# Altium schematic sheet 2 power supply.SchDoc
size A4; SheetNumber: 2; SheetTotal: 4
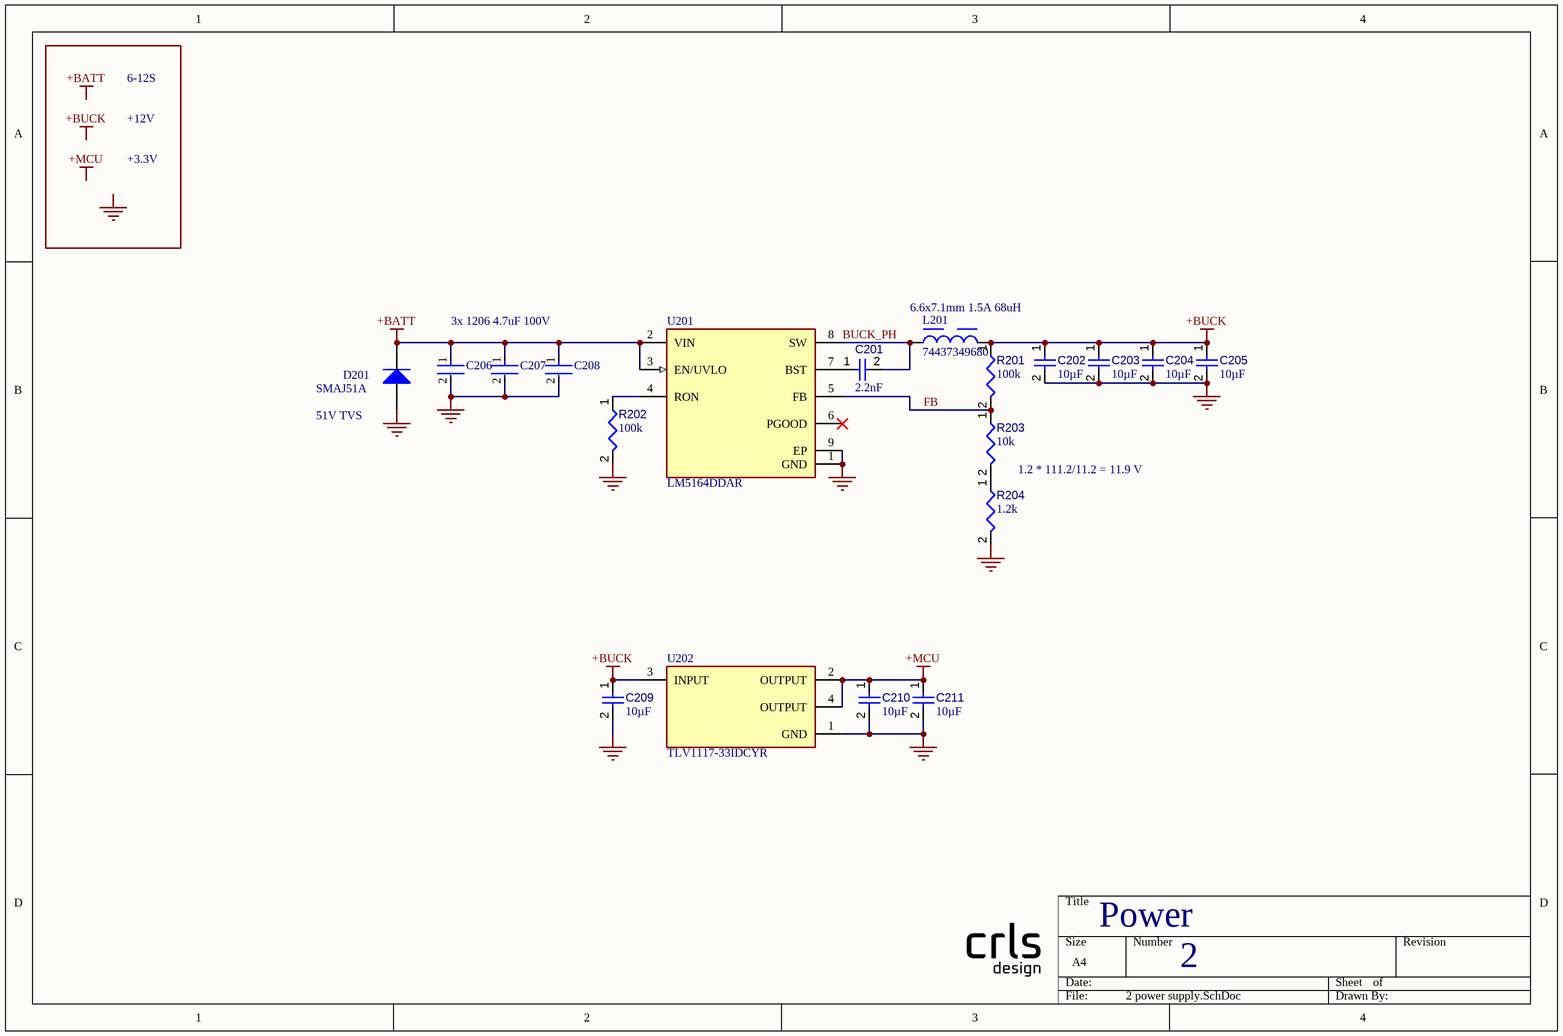
[diagram p0: 2 power supply.SchDoc]

## Parts
C201  value 2.2nF  [CAPC0402(1005)33_L]  (hidden comment: Capacitor 2.2nF +/-20% 50V 0402)
C202  value 10µF  [CAPC0603(1608)100_L]  (hidden comment: Capacitor 10µF +/-20% 10V 0603)
C203  value 10µF  [CAPC0603(1608)100_L]  (hidden comment: Capacitor 10µF +/-20% 10V 0603)
C204  value 10µF  [CAPC0603(1608)100_L]  (hidden comment: Capacitor 10µF +/-20% 10V 0603)
C205  value 10µF  [CAPC0603(1608)100_L]  (hidden comment: Capacitor 10µF +/-20% 10V 0603)
C206  12061Z475KAT2A  [FP-1206-L_3_2_0_2-W_1_6_0-MFG]  (value not drawn)
C207  12061Z475KAT2A  [FP-1206-L_3_2_0_2-W_1_6_0-MFG]  (value not drawn)
C208  12061Z475KAT2A  [FP-1206-L_3_2_0_2-W_1_6_0-MFG]  (value not drawn)
C209  value 10µF  [CAPC0603(1608)100_L]  (hidden comment: Capacitor 10µF +/-20% 10V 0603)
C210  value 10µF  [CAPC0603(1608)100_L]  (hidden comment: Capacitor 10µF +/-20% 10V 0603)
C211  value 10µF  [CAPC0603(1608)100_L]  (hidden comment: Capacitor 10µF +/-20% 10V 0603)
D201  SMAJ51A  [VISH-DO-214AC-2_N]
L201  74437349680  [WE-LHMI_7050]
R201  value 100k  [RESC0402(1005)_L]  (hidden comment: Resistor 100K +/-1 % 0402 63 mW)
R202  value 100k  [RESC0402(1005)_L]  (hidden comment: Resistor 100K +/-1 % 0402 63 mW)
R203  value 10k  [RESC0402(1005)_L]  (hidden comment: Resistor 10K  +/-1 % 0402 63 mW)
R204  value 1.2k  [RESC0402(1005)_L]  (hidden comment: Resistor 1K2 +/-1 % 0402 63 mW)
U201  LM5164DDAR  [FP-DDA0008E-MFG]
U202  TLV1117-33IDCYR  [FP-DCY0004A-MFG]

## Nets
+BATT: C206.1 C207.1 C208.1 D201.1(K) U201.2(VIN) U201.3(EN/UVLO)
+BUCK: C202.1 C203.1 C204.1 C205.1 C209.1 L201.2 R201.1 U202.3(INPUT)
+MCU: C210.1 C211.1 U202.2(OUTPUT) U202.4(OUTPUT)
GND: C202.2 C203.2 C204.2 C205.2 C206.2 C207.2 C208.2 C209.2 C210.2 C211.2 D201.2(A) R202.2 R204.2 U201.1(GND) U201.9(EP) U202.1(GND)
BUCK_PH: C201.2 L201.1 U201.8(SW)
FB: R201.2 R203.1 U201.5(FB)
NetC201_1: C201.1 U201.7(BST)
NetR202_1: R202.1 U201.4(RON)
NetR203_2: R203.2 R204.1

Not connected (* = marked no-connect by the designer): U201 6(PGOOD)*

## Notes on the sheet
- 6-12S
- +12V
- +3.3V
- 6.6x7.1mm 1.5A 68uH
- 3x 1206 4.7uF 100V
- (near D201) 51V TVS
- 1.2 * 111.2/11.2 = 11.9 V
- Power
- Labels drawn without touching a wire or pin: +BATT, +BUCK, +MCU, GND

## Library data of the parts
C201 = CMP-001-00066-3: Chip Capacitor, 1nF +/-20%, 50V, 0402, Thickness 0.33 mm; Tolerance: 10%; Case/Package: 0402; Pins: 2; Min Operating Temperature: -55°C; Max Operating Temperature: 85°C; Voltage Rating: 50V; Mounting Technology: SMT
C202-C205 C209-C211 = CMP-001-00075-4: Chip Capacitor, 10µF +/-20%, 10V, 0603, Thickness 1 mm; Tolerance: 10%; Voltage Rating: 10V; Max Operating Temperature: 85°C; Pins: 2; Case/Package: 0603; Mounting Technology: SMT; Min Operating Temperature: -55°C
C206-C208 = CMP-2000-05019-2: CAP CER 4.7UF 100V X7S 1206; Tolerance: 10%; Thickness: 0.075inch; Max Operating Temperature: 125°C; Termination: SMD/SMT; Dielectric: X7S; Case Code (Metric): 3216; Case/Package: 1206; Height: 0.5mm; Mount: Surface Mount; Voltage Rating (DC): 100V; Min Operating Temperature: -55°C; Package Quantity: 1; Length: 3.2mm; Voltage Rating: 100V; Lead Free: Lead Free; RoHS Compliant: Yes; Packaging: Tape and Reel; Weight: 0.000571oz; Capacitance: 4.7uF; REACH SVHC: No SVHC; Case Code (Imperial): 1206; Width: 0.063inch; Depth: 1.6mm
D201 = CMP-0544-00031-2: Transient Voltage Suppressor, 6.40 to 231 V, 51 V Stand-off Voltage, Uni-Directional, -55 to 155 degC, 2-pin DO-214AC, Pb-Free, Tape and Reel; Manufacturer: Vishay Semiconductor; PartNumber: SMAJ51A-E3/5A; IFSM: 40 A; ID (uA): 1; VBR Uni-Directional (V): 6.4 to 231; PPPM (W): 400, 300; VWM (V): 51; ComponentLink3Description: Package Specification; PackageDescription: 2-Pin DO-214AC (SMA), Body 4.245 x 2.665 mm; ComponentLink1Description: Manufacturer URL; ComponentLink2Description: Datasheet; ComponentLink3URL: http://www.vishay.com/docs/88390/smaj50a.pdf; DatasheetVersion: 12/8/2013; ComponentLink2URL: http://www.vishay.com/docs/88390/smaj50a.pdf; PackageReference: DO-214AC-2; RoHS: TRUE; Operating Junction and Storage Temperature Range: -55 to 150 degC; ComponentLink1URL: http://www.vishay.com/; Packing: Tape and Reel; Mounting Technology: Surface Mount
L201 = CMP-1353-00069-6: NexarPartId: 65255814; Inductance Tolerance: 20%; Saturation Current: 1.45A; Inductance: 68µH; DC Resistance (DCR): 386mΩ; Ambient Temperature Range High: 85°C; Ambient Temperature Range Low: -40°C; RoHS: Compliant; Length: 7.3mm; Min Operating Temperature: -40°C; Max Operating Temperature: 125°C; Height: 4.8mm; Width: 6.6mm
R201 R202 = CMP-009-00168-3: Chip Resistor, 100 kOhms, +/-1 %, 63 mW, -55 to 155 degC, 0402; Tolerance: 1%; Power: 63mW; Max Operating Temperature: 155°C; Min Operating Temperature: -55°C; Pins: 2; Case/Package: 0402
R203 = CMP-009-00149-3: Chip Resistor, 10 kOhms, +/-1 %, 63 mW, -55 to 125 degC, 0402; Power: 63mW; Tolerance: 1%; Min Operating Temperature: -55°C; Case/Package: 0402; Max Operating Temperature: 155°C; Pins: 2
R204 = CMP-009-00157-3: Chip Resistor, 1.2 kOhms, +/-1 %, 63 mW, -55 to 155 degC, 0402; Tolerance: 1%; Power: 63mW; Case/Package: 0402; Pins: 2; Min Operating Temperature: -55°C; Max Operating Temperature: 155°C
U201 = CMP-04918-000011-1: POWER MANAGEMENT; Manufacturer: Texas Instruments; Standoff Height: 0mm; Max Supply Voltage: 100V; Output Voltage: 1.2-90V; Max Duty Cycle: 99%; Nominal Supply Current: 600uA; Output Current: 1A; Min Supply Voltage: 6V; Output Type: AdjustableProgrammable; Max Junction Temp: +150°C; Number Of Outputs: 1; Switching Frequency: 1000kHz; Switching Topology: Buck; Temperature: -40°C to +150°C; Device Class L1: Integrated Circuits (ICs); Automotive: No; Lead Free: Yes; Package: DDA0008E; Device Class L3: Voltage Regulators - Switching; Manufacturer Part Number: LM5164DDAR; Device Class L2: Power Management ICs; RoHS: TRUE; Mouser Description: 6-V to 100-V input, 1-A synchronous buck DC-DC converter with ultra-low IQ 8-SO PowerPAD -40 to 150; Temperature Range Low: -40°C; ComponentLink2Description: Datasheet; Temperature Range High: +150°C; ComponentLink2URL: http://www.ti.com/lit/ds/symlink/lm5164.pdf; Digikey Description: POWER MANAGEMENT; Category: IC; Octopart: https://octopart.com/lm5164ddar-texas+instruments-96785744
U202 = CMP-04917-000056-1: IC REG LIN 3.3V 800MA SOT223-4; Manufacturer: Texas Instruments; Nominal Supply Current: 5mA; Dropout Voltage: 1.2V; Max Supply Voltage: 15V; Min Supply Voltage: 4.7V; Output Type: Fixed; Number Of Outputs: 1; Output Current: 0.8A; Standoff Height: 0.02mm; Max Junction Temp: +125°C; Lead Free: Yes; RoHS: TRUE; Temperature: -40°C to +125°C; Device Class L1: Integrated Circuits (ICs); Output Voltage: 3.3V; Device Class L3: Voltage Regulators - Linear; Octopart: https://octopart.com/tlv1117-33idcyr-texas+instruments-669250; Device Class L2: Power Management ICs; Package: DCY0004A; Temperature Range High: +125°C; Category: IC; Height: 1.8mm; Automotive: No; Digikey Description: IC REG LIN 3.3V 800MA SOT223-4; Temperature Range Low: -40°C; ComponentLink2URL: http://www.ti.com/lit/ds/symlink/tlv1117.pdf; ComponentLink2Description: Datasheet; Manufacturer Part Number: TLV1117-33IDCYR; Mouser Description: LDO Voltage Regulators Fixed LDO Volt Reg